# EAGLE schematic connections (EAGLE 7.6.0)
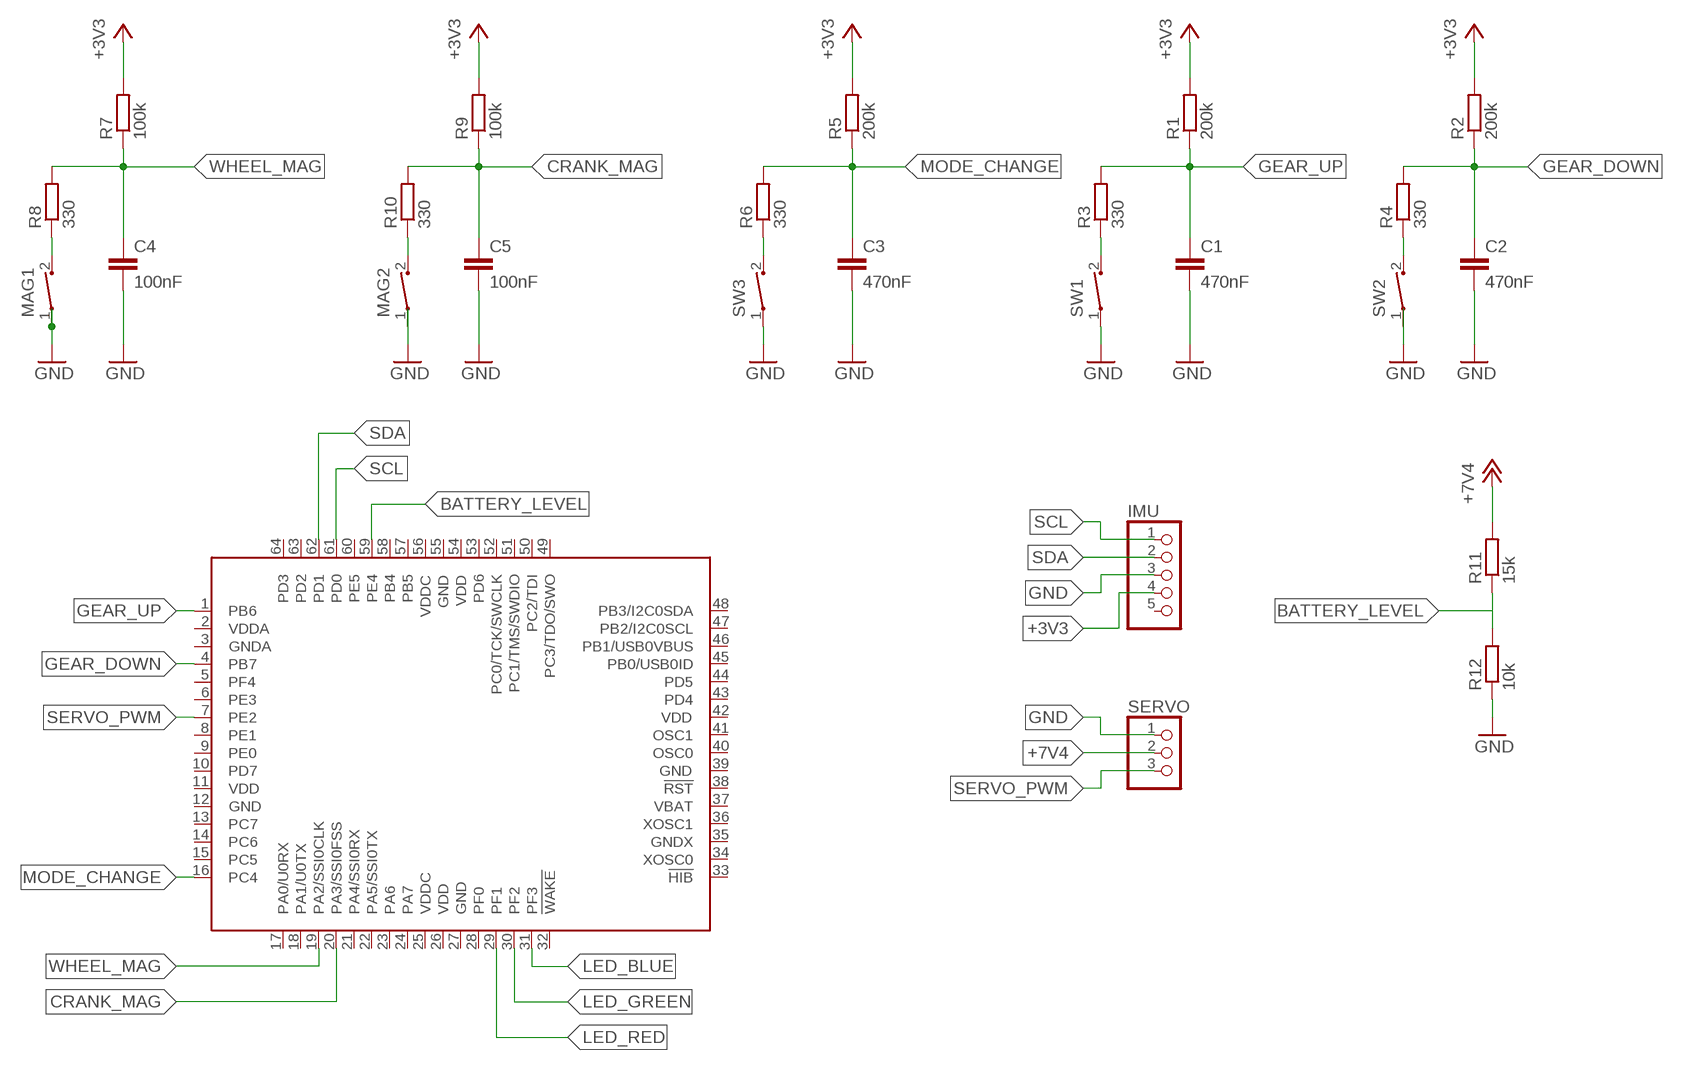
[diagram p0: schematic, sheet 1]

## Parts
C1  470nF  C2,5-3  [C2.5-3]
C2  470nF  C2,5-3  [C2.5-3]
C3  470nF  C2,5-3  [C2.5-3]
C4  100nF  C2,5-3  [C2.5-3]
C5  100nF  C2,5-3  [C2.5-3]
IC1  TM4C123[7,G]XXPM  [PM_S-PQFP-G64]
IMU  PINHD-1X5  [1X05]
MAG1  CT10-XXXX-A2  [CT10-XXXX-A2]
MAG2  CT10-XXXX-A2  [CT10-XXXX-A2]
R1  200k  R-EU_0204/5  [0204/5]
R2  200k  R-EU_0204/5  [0204/5]
R3  330  R-EU_0204/5  [0204/5]
R4  330  R-EU_0204/5  [0204/5]
R5  200k  R-EU_0204/5  [0204/5]
R6  330  R-EU_0204/5  [0204/5]
R7  100k  R-EU_0204/5  [0204/5]
R8  330  R-EU_0204/5  [0204/5]
R9  100k  R-EU_0204/5  [0204/5]
R10  330  R-EU_0204/5  [0204/5]
R11  15k  R-EU_0204/5  [0204/5]
R12  10k  R-EU_0204/5  [0204/5]
SERVO  PINHD-1X3  [1X03]
SW1  CT10-XXXX-A2  [CT10-XXXX-A2]
SW2  CT10-XXXX-A2  [CT10-XXXX-A2]
SW3  CT10-XXXX-A2  [CT10-XXXX-A2]

## Nets
+3V3: IMU.4 R1.2 R2.2 R5.2 R7.2 R9.2
+7V4: R11.2 SERVO.2
BATTERY_LEVEL: IC1.59(PE4) R11.1 R12.2
CRANK_MAG: C5.1 IC1.20(PA3/SSI0FSS) R9.1 R10.2
GEAR_DOWN: C2.1 IC1.4(PB7) R2.1 R4.2
GEAR_UP: C1.1 IC1.1(PB6) R1.1 R3.2
GND: C1.2 C2.2 C3.2 C4.2 C5.2 IMU.3 MAG1.1 R12.1 SERVO.1 SW1.1 SW3.1
LED_BLUE: IC1.31(PF3)
LED_GREEN: IC1.30(PF2)
LED_RED: IC1.29(PF1)
MODE_CHANGE: C3.1 IC1.16(PC4) R5.1 R6.2
N$1: R3.1 SW1.2
N$2: R4.1 SW2.2
N$3: R6.1 SW3.2
N$4: MAG1.2 R8.1
N$5: MAG2.2 R10.1
SCL: IC1.61(PD0) IMU.1
SDA: IC1.62(PD1) IMU.2
SERVO_PWM: IC1.7(PE2) SERVO.3
WHEEL_MAG: C4.1 IC1.19(PA2/SSI0CLK) R7.1 R8.2
Unconnected: IC1.2(VDDA) IC1.3(GNDA) IC1.5(PF4) IC1.6(PE3) IC1.8(PE1) IC1.9(PE0) IC1.10(PD7) IC1.11(VDD) IC1.12(GND) IC1.13(PC7) IC1.14(PC6) IC1.15(PC5) IC1.17(PA0/U0RX) IC1.18(PA1/U0TX) IC1.21(PA4/SSI0RX) IC1.22(PA5/SSI0TX) IC1.23(PA6) IC1.24(PA7) IC1.25(VDDC) IC1.26(VDD) IC1.27(GND) IC1.28(PF0) IC1.32(!WAKE) IC1.33(!HIB) IC1.34(XOSC0) IC1.35(GNDX) IC1.36(XOSC1) IC1.37(VBAT) IC1.38(!RST) IC1.39(GND) IC1.40(OSC0) IC1.41(OSC1) IC1.42(VDD) IC1.43(PD4) IC1.44(PD5) IC1.45(PB0/USB0ID) IC1.46(PB1/USB0VBUS) IC1.47(PB2/I2C0SCL) IC1.48(PB3/I2C0SDA) IC1.49(PC3/TDO/SWO) IC1.50(PC2/TDI) IC1.51(PC1/TMS/SWDIO) IC1.52(PC0/TCK/SWCLK) IC1.53(PD6) IC1.54(VDD) IC1.55(GND) IC1.56(VDDC) IC1.57(PB5) IC1.58(PB4) IC1.60(PE5) IC1.63(PD2) IC1.64(PD3) IMU.5 MAG2.1 SW2.1

## Library data of the parts
C1-C5 = capacitor-wima:C: CAPACITOR naming: grid - package width
IC1 = ti-tiva(2):TM4C123[7,G]XX
IMU = pinhead:PINHD-1X5: PIN HEADER
MAG1 MAG2 SW1-SW3 = switch-coto:CT10-XXXX-: CT10 Series Molded Switch Source: www.cotorelay.com .. Coto_Technology__CT10-1530-G1.pdf
R1-R12 = rcl:R-EU_: RESISTOR, European symbol
SERVO = pinhead:PINHD-1X3: PIN HEADER